# EAGLE schematic ArduinoDevBoardRevA (EAGLE 9.0.1)

## Sheet 1 of 2
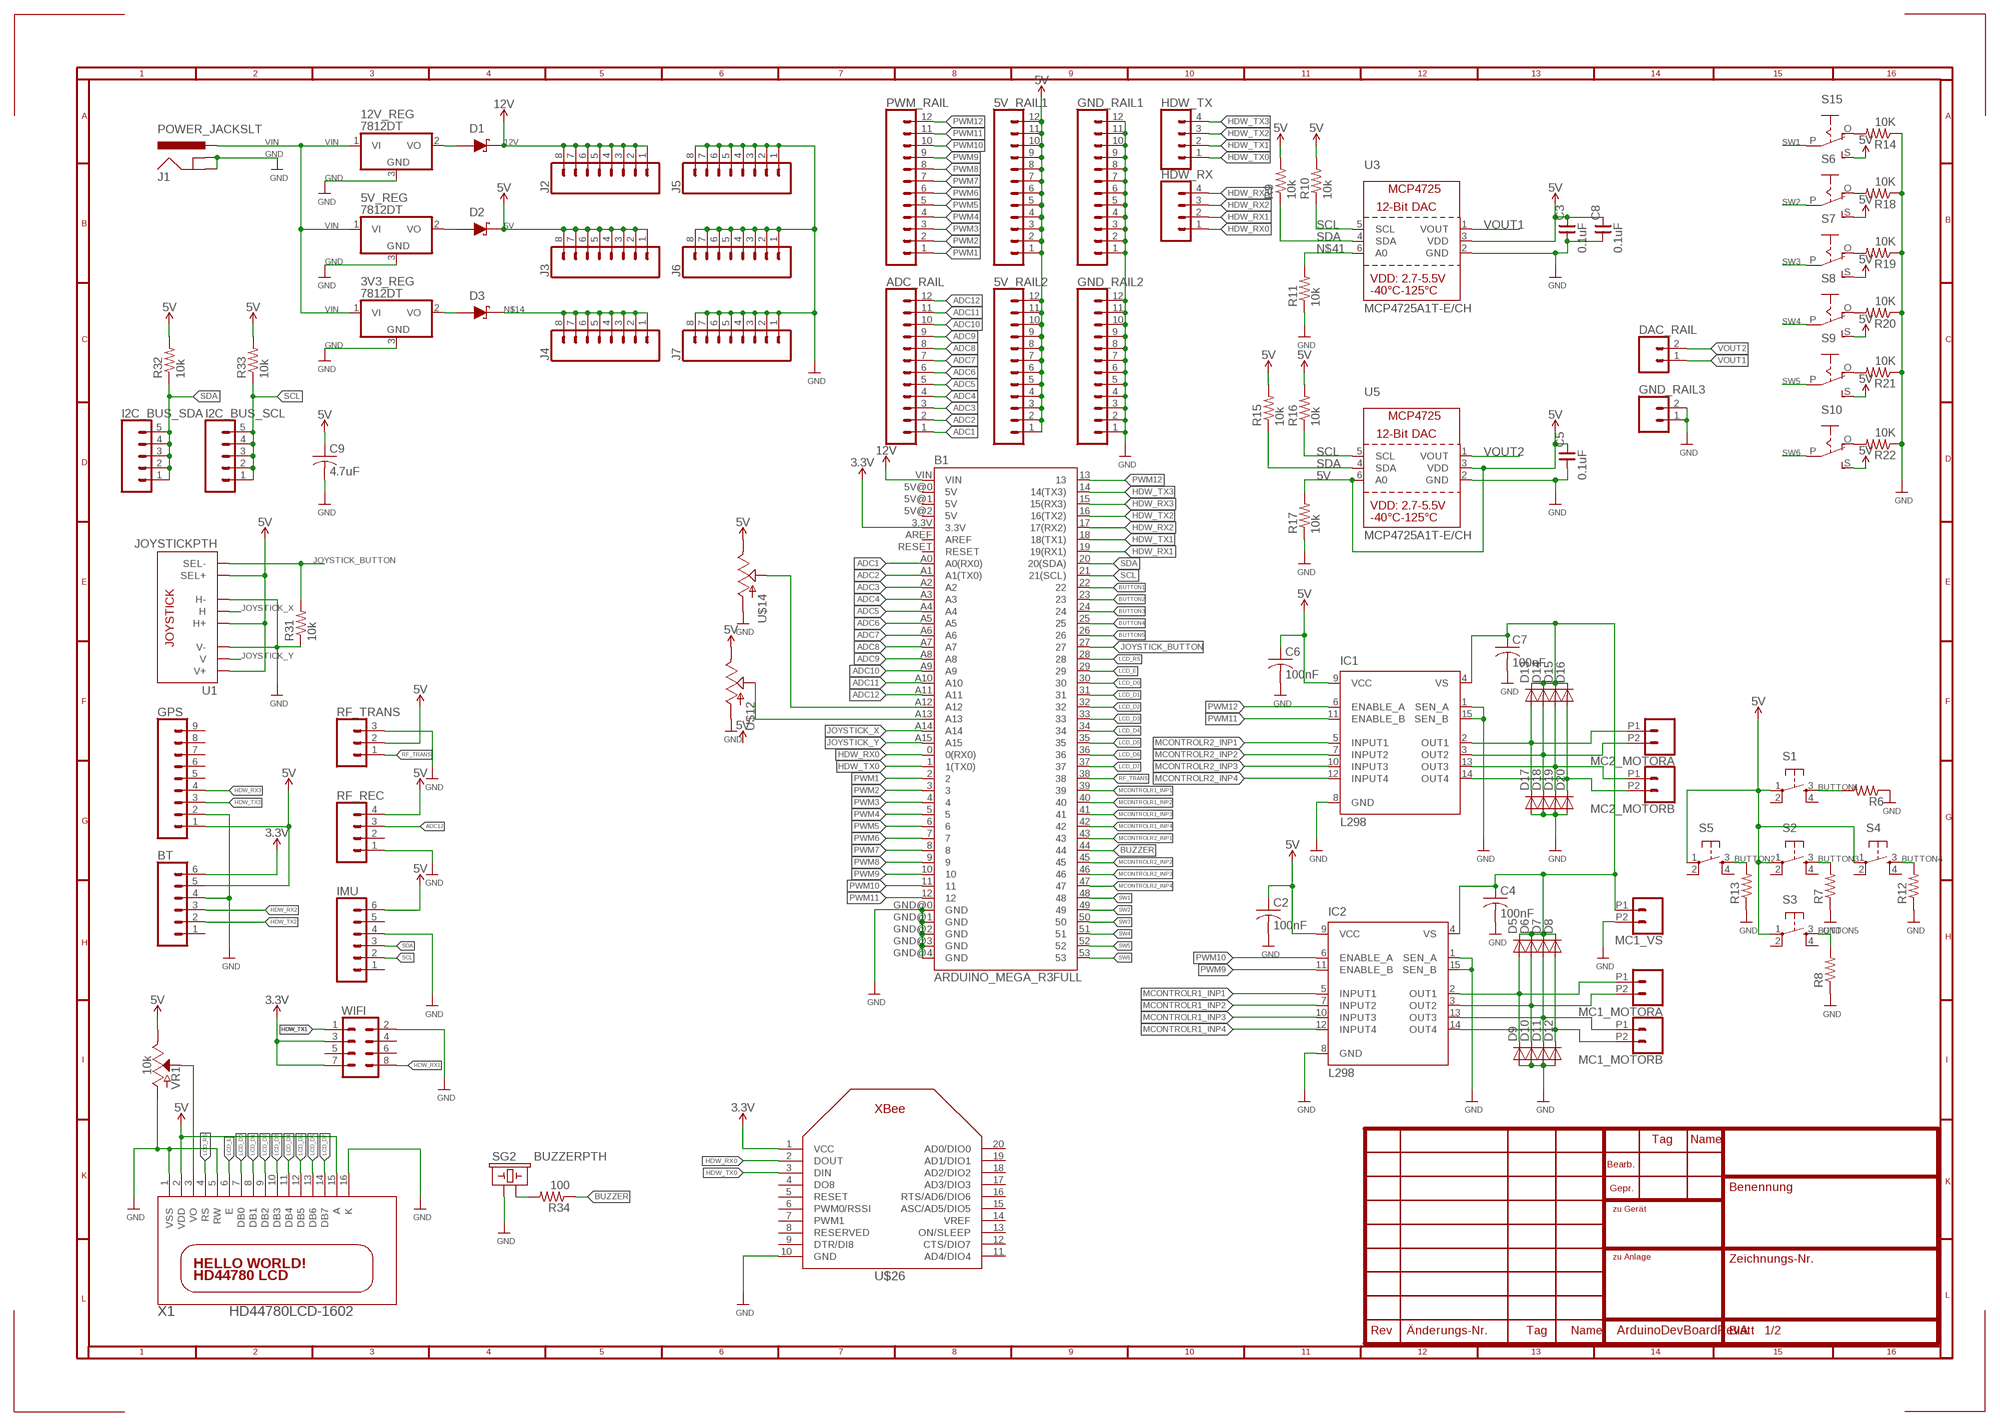
[diagram p0: schematic, sheet 1]

### Parts
3V3_REG  7812DT  [TO252]
5V_RAIL1  CONN_12  [1X12]
5V_RAIL2  CONN_12  [1X12]
5V_REG  7812DT  [TO252]
12V_REG  7812DT  [TO252]
ADC_RAIL  CONN_12  [1X12]
B1  ARDUINO_MEGA_R3FULL  [ARDUINO_MEGA]
BT  CONN_06SILK_FEMALE_PTH  [1X06]
C2  100nF  C-US050-024X044  [C050-024X044]
C3  0.1uF  CNP-0805  [0805]
C4  100nF  C-US050-024X044  [C050-024X044]
C5  0.1uF  CNP-0805  [0805]
C6  100nF  C-US050-024X044  [C050-024X044]
C7  100nF  C-US050-024X044  [C050-024X044]
C8  0.1uF  CNP-0805  [0805]
C9  4.7uF  C-US050-024X044  [C050-024X044]
D1  D_SCHOTTKYK  [SOD-123]
D2  D_SCHOTTKYK  [SOD-123]
D3  D_SCHOTTKYK  [SOD-123]
D5  DIODE-D-5  [D-5]
D6  DIODE-D-5  [D-5]
D7  DIODE-D-5  [D-5]
D8  DIODE-D-5  [D-5]
D9  DIODE-D-5  [D-5]
D10  DIODE-D-5  [D-5]
D11  DIODE-D-5  [D-5]
D12  DIODE-D-5  [D-5]
D13  DIODE-D-5  [D-5]
D14  DIODE-D-5  [D-5]
D15  DIODE-D-5  [D-5]
D16  DIODE-D-5  [D-5]
D17  DIODE-D-5  [D-5]
D18  DIODE-D-5  [D-5]
D19  DIODE-D-5  [D-5]
D20  DIODE-D-5  [D-5]
DAC_RAIL  CONN_02  [1X02]
GND_RAIL1  CONN_12  [1X12]
GND_RAIL2  CONN_12  [1X12]
GND_RAIL3  CONN_02  [1X02]
GPS  CONN_09  [1X09]
HDW_RX  CONN_04  [1X04]
HDW_TX  CONN_04  [1X04]
I2C_BUS_SCL  CONN_05  [1X05]
I2C_BUS_SDA  CONN_05  [1X05]
IC1  L298  [MULTIWATT-15]
IC2  L298  [MULTIWATT-15]
IMU  CONN_06SILK_FEMALE_PTH  [1X06]
J1  POWER_JACKSLT  [POWER_JACK_SLOT]
J2  CONN_08"  [1X08]
J3  CONN_08"  [1X08]
J4  CONN_08"  [1X08]
J5  CONN_08"  [1X08]
J6  CONN_08"  [1X08]
J7  CONN_08"  [1X08]
MC1_MOTORA  CONN_022.54MM_SCREWTERM  [1X02_2.54_SCREWTERM]
MC1_MOTORB  CONN_022.54MM_SCREWTERM  [1X02_2.54_SCREWTERM]
MC1_VS  CONN_022.54MM_SCREWTERM  [1X02_2.54_SCREWTERM]
MC2_MOTORA  CONN_022.54MM_SCREWTERM  [1X02_2.54_SCREWTERM]
MC2_MOTORB  CONN_022.54MM_SCREWTERM  [1X02_2.54_SCREWTERM]
PWM_RAIL  CONN_12  [1X12]
R6  R-US_R0805  [R0805]
R7  R-US_R0805  [R0805]
R8  R-US_R0805  [R0805]
R9  10k  R-US_R0805  [R0805]
R10  10k  R-US_R0805  [R0805]
R11  10k  R-US_R0805  [R0805]
R12  R-US_R0805  [R0805]
R13  R-US_R0805  [R0805]
R14  10K  R-US_R0805  [R0805]
R15  10k  R-US_R0805  [R0805]
R16  10k  R-US_R0805  [R0805]
R17  10k  R-US_R0805  [R0805]
R18  10K  R-US_R0805  [R0805]
R19  10K  R-US_R0805  [R0805]
R20  10K  R-US_R0805  [R0805]
R21  10K  R-US_R0805  [R0805]
R22  10K  R-US_R0805  [R0805]
R31  10k  R-US_R0805  [R0805]
R32  10k  R-US_R0805  [R0805]
R33  10k  R-US_R0805  [R0805]
R34  100  R-US_R0805  [R0805]
RF_REC  CONN_04  [1X04]
RF_TRANS  CONN_03  [1X03]
S1  TAC_SWITCHSMD  [TACTILE_SWITCH_SMD]
S2  TAC_SWITCHSMD  [TACTILE_SWITCH_SMD]
S3  TAC_SWITCHSMD  [TACTILE_SWITCH_SMD]
S4  TAC_SWITCHSMD  [TACTILE_SWITCH_SMD]
S5  TAC_SWITCHSMD  [TACTILE_SWITCH_SMD]
S6  EG1218S  [EG1218]
S7  EG1218S  [EG1218]
S8  EG1218S  [EG1218]
S9  EG1218S  [EG1218]
S10  EG1218S  [EG1218]
S15  EG1218S  [EG1218]
SG2  BUZZERPTH  [BUZZER-12MM]
U1  JOYSTICKPTH  [JOYSTICK]
U3  MCP4725A1T-E/CH  DAC_MCP4725  [SOT23-6]
U5  MCP4725A1T-E/CH  DAC_MCP4725  [SOT23-6]
U$12  POT  [ALPS_POT]
U$14  POT  [ALPS_POT]
U$26  XBEE  [XBEE]
VR1  10k  POTENTIOMETER-PTH-9MM-1/20W-20%-KIT  [POT-PTH-ALPS-KIT]
WIFI  CONN_04X2  [2X4]
X1  HD44780LCD-1602  [LCD1602]

### Nets
3.3V: B1.3.3V BT.6 U$26.1(VCC) WIFI.3 WIFI.7
5V: 5V_RAIL1.1 5V_RAIL1.2 5V_RAIL1.3 5V_RAIL1.4 5V_RAIL1.5 5V_RAIL1.6 5V_RAIL1.7 5V_RAIL1.8 5V_RAIL1.9 5V_RAIL1.10 5V_RAIL1.11 5V_RAIL1.12 5V_RAIL2.1 5V_RAIL2.2 5V_RAIL2.3 5V_RAIL2.4 5V_RAIL2.5 5V_RAIL2.6 5V_RAIL2.7 5V_RAIL2.8 5V_RAIL2.9 5V_RAIL2.10 5V_RAIL2.11 5V_RAIL2.12 BT.5 C2.1 C3.2 C5.2 C6.1 C8.2 C9.1 D2.2(C) GPS.1 IC1.9(VCC) IC2.9(VCC) IMU.6 J3.1 J3.2 J3.3 J3.4 J3.5 J3.6 J3.7 J3.8 R9.2 R10.2 R15.2 R16.2 R17.2 R32.2 R33.2 RF_REC.4 RF_TRANS.2 S1.1 S2.1 S3.1 S4.1 S5.1 S6.S S7.S S8.S S9.S S10.S S15.S U1.B1A(SEL+) U1.H1(H+) U1.V1(V+) U3.3(VDD) U5.3(VDD) U5.6(A0) U$12.P$1(E) U$14.P$1(E) VR1.P$1(E) X1.2(VDD) X1.15(A) ; also sheet 2
12V: B1.VIN D1.2(C) J2.1 J2.2 J2.3 J2.4 J2.5 J2.6 J2.7 J2.8
ADC1: ADC_RAIL.1 B1.A0(A0(RX0)) ; also sheet 2
ADC2: ADC_RAIL.2 B1.A1(A1(TX0)) ; also sheet 2
ADC3: ADC_RAIL.3 B1.A2 ; also sheet 2
ADC4: ADC_RAIL.4 B1.A3
ADC5: ADC_RAIL.5 B1.A4
ADC6: ADC_RAIL.6 B1.A5
ADC7: ADC_RAIL.7 B1.A6
ADC8: ADC_RAIL.8 B1.A7
ADC9: ADC_RAIL.9 B1.A8
ADC10: ADC_RAIL.10 B1.A9
ADC11: ADC_RAIL.11 B1.A10
ADC12: ADC_RAIL.12 B1.A11 RF_REC.3
BUTTON1: B1.22 R6.2 S1.3
BUTTON2: B1.23 R13.2 S5.3
BUTTON3: B1.24 R7.2 S2.3
BUTTON4: B1.25 R12.2 S4.3
BUTTON5: B1.26 R8.2 S3.3
BUZZER: B1.44 R34.1
GND: 3V3_REG.3(GND) 5V_REG.3(GND) 12V_REG.3(GND) B1.GND@0(GND) B1.GND@1(GND) B1.GND@2(GND) B1.GND@3(GND) B1.GND@4(GND) BT.4 C2.2 C3.1 C4.2 C5.1 C6.2 C7.2 C8.1 C9.2 D9.A D10.A D11.A D12.A D17.A D18.A D19.A D20.A GND_RAIL1.1 GND_RAIL1.2 GND_RAIL1.3 GND_RAIL1.4 GND_RAIL1.5 GND_RAIL1.6 GND_RAIL1.7 GND_RAIL1.8 GND_RAIL1.9 GND_RAIL1.10 GND_RAIL1.11 GND_RAIL1.12 GND_RAIL2.1 GND_RAIL2.2 GND_RAIL2.3 GND_RAIL2.4 GND_RAIL2.5 GND_RAIL2.6 GND_RAIL2.7 GND_RAIL2.8 GND_RAIL2.9 GND_RAIL2.10 GND_RAIL2.11 GND_RAIL2.12 GND_RAIL3.1 GND_RAIL3.2 GPS.2 IC1.1(SEN_A) IC1.8(GND) IC1.15(SEN_B) IC2.1(SEN_A) IC2.8(GND) IC2.15(SEN_B) IMU.4 J1.GND@1(GNDBREAK) J1.GND@2(GND) J5.1 J5.2 J5.3 J5.4 J5.5 J5.6 J5.7 J5.8 J6.1 J6.2 J6.3 J6.4 J6.5 J6.6 J6.7 J6.8 J7.1 J7.2 J7.3 J7.4 J7.5 J7.6 J7.7 J7.8 MC1_VS.P2 R6.1 R7.1 R8.1 R11.1 R12.1 R13.1 R14.1 R17.1 R18.1 R19.1 R20.1 R21.1 R22.1 R31.1 RF_REC.1 RF_TRANS.3 SG2.+ U1.H3(H-) U1.V3(V-) U3.2(GND) U5.2(GND) U$12.P$3(A) U$14.P$3(A) U$26.10(GND) VR1.P$3(A) WIFI.2 X1.1(VSS) X1.5(RW) X1.16(K) ; also sheet 2
HDW_RX0: B1.0(0(RX0)) HDW_RX.1 U$26.2(DOUT)
HDW_RX1: B1.19(19(RX1)) HDW_RX.2 WIFI.8
HDW_RX2: B1.17(17(RX2)) BT.3 HDW_RX.3
HDW_RX3: B1.15(15(RX3)) GPS.4 HDW_RX.4
HDW_TX0: B1.1(1(TX0)) HDW_TX.1 U$26.3(DIN)
HDW_TX1: B1.18(18(TX1)) HDW_TX.2 WIFI.1
HDW_TX2: B1.16(16(TX2)) BT.2 HDW_TX.3
HDW_TX3: B1.14(14(TX3)) GPS.3 HDW_TX.4
JOYSTICK_BUTTON: B1.27 R31.2 U1.B2A(SEL-)
JOYSTICK_X: B1.A14 U1.H2(H)
JOYSTICK_Y: B1.A15 U1.V2(V)
LCD_D0: B1.30 X1.7(DB0)
LCD_D1: B1.31 X1.8(DB1)
LCD_D2: B1.32 X1.9(DB2)
LCD_D3: B1.33 X1.10(DB3)
LCD_D4: B1.34 X1.11(DB4)
LCD_D5: B1.35 X1.12(DB5)
LCD_D6: B1.36 X1.13(DB6)
LCD_D7: B1.37 X1.14(DB7)
LCD_E: B1.29 X1.6(E)
LCD_RS: B1.28 X1.4(RS)
MCONTROLR1_INP1: B1.39 IC2.5(INPUT1)
MCONTROLR1_INP2: B1.40 IC2.7(INPUT2)
MCONTROLR1_INP3: B1.41 IC2.10(INPUT3)
MCONTROLR1_INP4: B1.42 IC2.12(INPUT4)
MCONTROLR2_INP1: B1.43 IC1.5(INPUT1)
MCONTROLR2_INP2: B1.45 IC1.7(INPUT2)
MCONTROLR2_INP3: B1.46 IC1.10(INPUT3)
MCONTROLR2_INP4: B1.47 IC1.12(INPUT4)
N$5: 12V_REG.2(VO) D1.1(A)
N$10: 5V_REG.2(VO) D2.1(A)
N$11: 3V3_REG.2(VO) D3.1(A)
N$12: C4.1 C7.1 D5.C D6.C D7.C D8.C D13.C D14.C D15.C D16.C IC1.4(VS) IC2.4(VS) MC1_VS.P1
N$14: D3.2(C) J4.1 J4.2 J4.3 J4.4 J4.5 J4.6 J4.7 J4.8
N$33: D13.A D17.C IC1.2(OUT1) MC2_MOTORA.P1
N$34: D14.A D18.C IC1.3(OUT2) MC2_MOTORA.P2
N$35: D15.A D19.C IC1.13(OUT3) MC2_MOTORB.P1
N$36: D16.A D20.C IC1.14(OUT4) MC2_MOTORB.P2
N$37: B1.A12 U$14.P$2(S)
N$38: B1.A13 U$12.P$2(S)
N$39: VR1.P$2(S) X1.3(VO)
N$40: R34.2 SG2.-
N$41: R11.2 U3.6(A0)
N$46: D5.A D9.C IC2.2(OUT1) MC1_MOTORA.P1
N$47: D6.A D10.C IC2.3(OUT2) MC1_MOTORA.P2
N$48: D7.A D11.C IC2.13(OUT3) MC1_MOTORB.P1
N$49: D8.A D12.C IC2.14(OUT4) MC1_MOTORB.P2
N$50: R14.2 S15.O
N$52: R18.2 S6.O
N$53: R19.2 S7.O
N$54: R20.2 S8.O
N$55: R21.2 S9.O
N$56: R22.2 S10.O
PWM1: B1.2 PWM_RAIL.1
PWM2: B1.3 PWM_RAIL.2
PWM3: B1.4 PWM_RAIL.3
PWM4: B1.5 PWM_RAIL.4
PWM5: B1.6 PWM_RAIL.5
PWM6: B1.7 PWM_RAIL.6
PWM7: B1.8 PWM_RAIL.7
PWM8: B1.9 PWM_RAIL.8
PWM9: B1.10 IC2.11(ENABLE_B) PWM_RAIL.9
PWM10: B1.11 IC2.6(ENABLE_A) PWM_RAIL.10
PWM11: B1.12 IC1.11(ENABLE_B) PWM_RAIL.11
PWM12: B1.13 IC1.6(ENABLE_A) PWM_RAIL.12
RF_TRANS: B1.38 RF_TRANS.1
SCL: B1.21(21(SCL)) I2C_BUS_SCL.1 I2C_BUS_SCL.2 I2C_BUS_SCL.3 I2C_BUS_SCL.4 I2C_BUS_SCL.5 IMU.2 R10.1 R16.1 R33.1 U3.5(SCL) U5.5(SCL) ; also sheet 2
SDA: B1.20(20(SDA)) I2C_BUS_SDA.1 I2C_BUS_SDA.2 I2C_BUS_SDA.3 I2C_BUS_SDA.4 I2C_BUS_SDA.5 IMU.3 R9.1 R15.1 R32.1 U3.4(SDA) U5.4(SDA) ; also sheet 2
SW1: B1.48 S15.P
SW2: B1.49 S6.P
SW3: B1.50 S7.P
SW4: B1.51 S8.P
SW5: B1.52 S9.P
SW6: B1.53 S10.P
VIN: 3V3_REG.1(VI) 5V_REG.1(VI) 12V_REG.1(VI) J1.PWR
VOUT1: DAC_RAIL.1 U3.1(VOUT)
VOUT2: DAC_RAIL.2 U5.1(VOUT)
Unconnected: B1.5V@0(5V) B1.5V@1(5V) B1.5V@2(5V) B1.AREF B1.RESET BT.1 GPS.5 GPS.6 GPS.7 GPS.8 GPS.9 IMU.1 IMU.5 RF_REC.2 S1.2 S1.4 S2.2 S2.4 S3.2 S3.4 S4.2 S4.4 S5.2 S5.4 U$26.4(DO8) U$26.5(RESET) U$26.6(PWM0/RSSI) U$26.7(PWM1) U$26.8(RESERVED) U$26.9(DTR/DI8) U$26.11(AD4/DIO4) U$26.12(CTS/DIO7) U$26.13(ON/SLEEP) U$26.14(VREF) U$26.15(ASC/AD5/DIO5) U$26.16(RTS/AD6/DIO6) U$26.17(AD3/DIO3) U$26.18(AD2/DIO2) U$26.19(AD1/DIO1) U$26.20(AD0/DIO0) WIFI.4 WIFI.5 WIFI.6

## Sheet 2 of 2
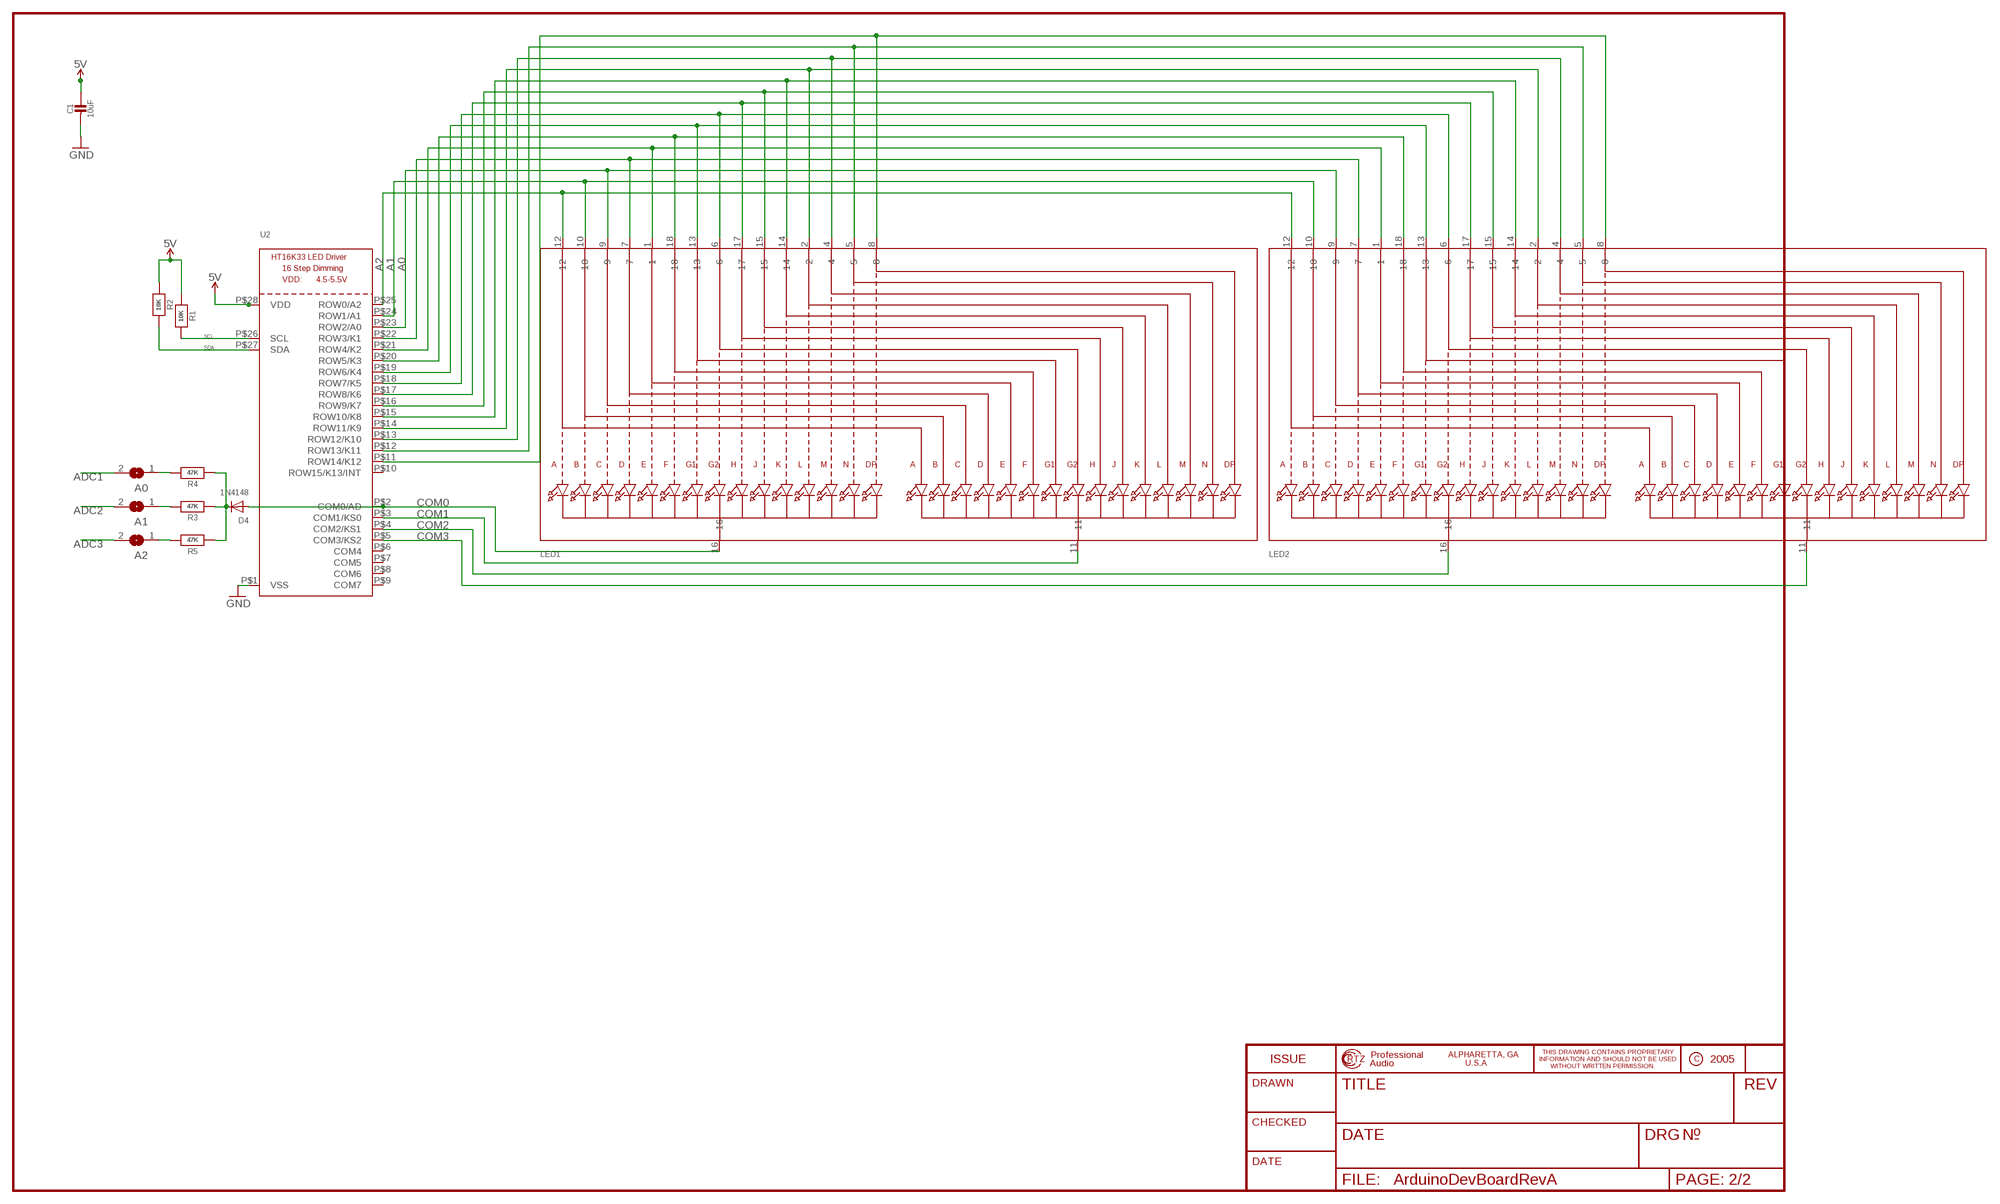
[diagram p1: schematic, sheet 2]

### Parts
A0  SOLDERJUMPERREFLOW_NOPASTE  [SOLDERJUMPER_REFLOW_NOPASTE]
A1  SOLDERJUMPERREFLOW_NOPASTE  [SOLDERJUMPER_REFLOW_NOPASTE]
A2  SOLDERJUMPERREFLOW_NOPASTE  [SOLDERJUMPER_REFLOW_NOPASTE]
C1  10uF  CAP_CERAMIC0805-NOOUTLINE  [0805-NO]
D4  1N4148  DIODESOD-323F  [SOD-323F]
LED1  DISP_SEGMENT_STARBURST_DUAL_COMMONCATHODE  [SEGMENT_STARTBUST_DUAL_KWA-541CBB]
LED2  DISP_SEGMENT_STARBURST_DUAL_COMMONCATHODE  [SEGMENT_STARTBUST_DUAL_KWA-541CBB]
R1  10K  RESISTOR0805_NOOUTLINE  [0805-NO]
R2  10K  RESISTOR0805_NOOUTLINE  [0805-NO]
R3  47K  RESISTOR0805_NOOUTLINE  [0805-NO]
R4  47K  RESISTOR0805_NOOUTLINE  [0805-NO]
R5  47K  RESISTOR0805_NOOUTLINE  [0805-NO]
U2  HT16K33_SOP28  [SOP28_300MIL]

### Nets
5V: R1.1 R2.1 U2.P$28(VDD) ; also sheet 1
A0: LED1.9 LED2.9 U2.P$23(ROW2/A0)
A1: LED1.10 LED2.10 U2.P$24(ROW1/A1)
A2: LED1.12 LED2.12 U2.P$25(ROW0/A2)
ADC1: A0.2 ; also sheet 1
ADC2: A1.2 ; also sheet 1
ADC3: A2.2 ; also sheet 1
COM0: D4.A LED1.16 U2.P$2(COM0/AD)
COM1: LED1.11 U2.P$3(COM1/KS0)
COM2: LED2.16 U2.P$4(COM2/KS1)
COM3: LED2.11 U2.P$5(COM3/KS2)
GND: C1.2 U2.P$1(VSS) ; also sheet 1
N$1: C1.1
N$16: LED1.7 LED2.7 U2.P$22(ROW3/K1)
N$17: LED1.1 LED2.1 U2.P$21(ROW4/K2)
N$18: LED1.18 LED2.18 U2.P$20(ROW5/K3)
N$19: A1.1 R3.2
N$20: A0.1 R4.2
N$21: LED1.13 LED2.13 U2.P$19(ROW6/K4)
N$22: LED1.6 LED2.6 U2.P$18(ROW7/K5)
N$23: D4.C R3.1 R4.1 R5.1
N$24: A2.1 R5.2
N$25: LED1.17 LED2.17 U2.P$17(ROW8/K6)
N$26: LED1.15 LED2.15 U2.P$16(ROW9/K7)
N$27: LED1.14 LED2.14 U2.P$15(ROW10/K8)
N$28: LED1.2 LED2.2 U2.P$14(ROW11/K9)
N$29: LED1.4 LED2.4 U2.P$13(ROW12/K10)
N$30: LED1.5 LED2.5 U2.P$12(ROW13/K11)
N$31: LED1.8 LED2.8 U2.P$11(ROW14/K12)
SCL: R1.2 U2.P$26(SCL) ; also sheet 1
SDA: R2.2 U2.P$27(SDA) ; also sheet 1
Unconnected: U2.P$6(COM4) U2.P$7(COM5) U2.P$8(COM6) U2.P$9(COM7) U2.P$10(ROW15/K13/INT)

## Library data of the parts
3V3_REG 5V_REG 12V_REG = adafruit:78*: Positive VOLTAGE REGULATOR Added bigger pads to the TO-92 package
5V_RAIL1 5V_RAIL2 ADC_RAIL GND_RAIL1 GND_RAIL2 PWM_RAIL = SparkFun-Connectors:CONN_12: Multi connection point. Often used as Generic Header-pin footprint for 0.1 inch spaced/style header connections On any of the 0.1 inch spaced packages, you can populate with these: Break Away Headers - Straight <https://www.sparkfun.com/products/116> (PRT-00116) Break Away Male Headers - Right Angle <https://www.sparkfun.com/products/553> (PRT-00553) Female Headers <https://www.sparkfun.com/products/115> (PRT-00115) Break Away Headers - Machine Pin <https://www.sparkfun.com/products/117> (PRT-00117) Break Away Female Headers - Swiss Machine Pin <https://www.sparkfun.com/products/743> (PRT-00743) For SCREWTERMINALS and SPRING TERMINALS visit here: Screw Terimnals on SparkFun.com <https://www.sparkfun.com/search/results?term=Screw+Terminals> (5mm/3.5mm/2.54mm spacing) This device is also useful as a general connection point to wire up your design to another part of your project. Our various solder wires solder well into these plated through hole pads. Hook-Up Wire - Assortment (Stranded, 22 AWG) <https://www.sparkfun.com/products/11375> (PRT-11375) Hook-Up Wire - Assortment (Solid Core, 22 AWG) <https://www.sparkfun.com/products/11367> (PRT-11367) View the entire wire category on our website here <https://www.sparkfun.com/categories/141> Special notes: Molex polarized connector foot print use with SKU : PRT-08231 with associated crimp pins and housings. 1MM SMD Version SKU: PRT-10208 NOTES ON THE VARIANTS LOCK and LOCK_LONGPADS... This footprint was designed to help hold the alignment of a through-hole component (i.e. 6-pin header) while soldering it into place. You may notice that each hole has been shifted either up or down by 0.005 of an inch from it's more standard position (which is a perfectly straight line). This slight alteration caused the pins (the squares in the middle) to touch the edges of the holes. Because they are alternating, it causes a "brace" to hold the component in place. 0.005 has proven to be the perfect amount of "off-center" position when using our standard breakaway headers. Although looks a little odd when you look at the bare footprint, once you have a header in there, the alteration is very hard to notice. Also,if you push a header all the way into place, it is covered up entirely on the bottom side.
A0 A1 A2 = microbuilder:SOLDERJUMPER: SMD Solder JUMPER Solder the two pads together to create a connection, or remove the solder to break it. REFLOW - Use this footprint for solder paste and reflow ovens. WAVE - Use this footprint for hand-soldering (larger pads). CLOSED - Has a trace between the two pads to ensure it is closed by default. The trace needs to be cut to disable the jumper, and can be closed again by creating a solder bridge between the two pads.
B1 = SparkFun-Boards:ARDUINO_MEGA_R3: Arduino Mega R3 ATmega2560 R3 compatible footprint. SparkFun Products: Arduino Mega 2560 R3 <https://www.sparkfun.com/products/11061>
BT IMU = SparkFun-Connectors:CONN_06: Multi connection point. Often used as Generic Header-pin footprint for 0.1 inch spaced/style header connections On any of the 0.1 inch spaced packages, you can populate with these: Break Away Headers - Straight <https://www.sparkfun.com/products/116> (PRT-00116) Break Away Male Headers - Right Angle <https://www.sparkfun.com/products/553> (PRT-00553) Female Headers <https://www.sparkfun.com/products/115> (PRT-00115) Break Away Headers - Machine Pin <https://www.sparkfun.com/products/117> (PRT-00117) Break Away Female Headers - Swiss Machine Pin <https://www.sparkfun.com/products/743> (PRT-00743) Arduino Stackable Header - 6 Pin <https://www.sparkfun.com/products/9280> (PRT-09280) For SCREWTERMINALS and SPRING TERMINALS visit here: Screw Terimnals on SparkFun.com <https://www.sparkfun.com/search/results?term=Screw+Terminals> (5mm/3.5mm/2.54mm spacing) This device is also useful as a general connection point to wire up your design to another part of your project. Our various solder wires solder well into these plated through hole pads. Hook-Up Wire - Assortment (Stranded, 22 AWG) <https://www.sparkfun.com/products/11375> (PRT-11375) Hook-Up Wire - Assortment (Solid Core, 22 AWG) <https://www.sparkfun.com/products/11367> (PRT-11367) View the entire wire category on our website here <https://www.sparkfun.com/categories/141>; PROD_ID: CONN-08437
C1 = microbuilder:CAP_CERAMIC: Ceramic Capacitors For new designs, use the packages preceded by an '_' character since they are more reliable: The following footprints should be used on most boards: _0402 - Standard footprint for regular board layouts _0603 - Standard footprint for regular board layouts _0805 - Standard footprint for regular board layouts _1206 - Standard footprint for regular board layouts For extremely tight-pitch boards where space is at a premium, the following 'micro-pitch' footprints can be used (smaller pads, no silkscreen outline, etc.): _0402MP - Micro-pitch footprint for very dense/compact boards _0603MP - Micro-pitch footprint for very dense/compact boards _0805MP - Micro-pitch footprint for very dense/compact boards _1206MP - Micro-pitch footprint for very dense/compact boards
C2 C4 C6 C7 C9 = rcl:C-US: CAPACITOR, American symbol; SPICEPREFIX: C
C3 C5 C8 = cap-master:CNP-: NON-POLARIZED CAP
D1-D3 = MAX9812:D_SCHOTTKY: Schottky diodes in various packages
D4 = adafruit:DIODE: Diode SMADIODE - SMA Surface Mount Package 20V 1A Schottky Diode Digikey: 641-1014-6-ND DO-1N4148 - Through Hole Small Current Diode SOD-123 20V 1 A (.5mV Vf) Schottky Diode - Digikey: MBRX120TPMSCT-ND SOD-323 10V 570mA (.38mV Vf, 3ns) Schottky Diode - Digikey: ZLLS410CT-ND SOD-523 30V 30mA Schottky Diode (RB751S-40TE61) - Digikey: RB751S-40TE61CT-ND SOT23-R/W - SOT23 Package (R = Solder Paste/Reflow Ovens, W = Hand-Soldering) BAT54Film 40V 300mA - Digikey: 497-7162-1-ND
D5-D20 = diode:DIODE-: DIODE
DAC_RAIL GND_RAIL3 MC1_MOTORA MC1_MOTORB MC1_VS MC2_MOTORA MC2_MOTORB = SparkFun-Connectors:CONN_02: Multi connection point. Often used as Generic Header-pin footprint for 0.1 inch spaced/style header connections On any of the 0.1 inch spaced packages, you can populate with these: Break Away Headers - Straight <https://www.sparkfun.com/products/116> (PRT-00116) Break Away Male Headers - Right Angle <https://www.sparkfun.com/products/553> (PRT-00553) Female Headers <https://www.sparkfun.com/products/115> (PRT-00115) Break Away Headers - Machine Pin <https://www.sparkfun.com/products/117> (PRT-00117) Break Away Female Headers - Swiss Machine Pin <https://www.sparkfun.com/products/743> (PRT-00743) For SCREWTERMINALS and SPRING TERMINALS visit here: Screw Terimnals on SparkFun.com <https://www.sparkfun.com/search/results?term=Screw+Terminals> (5mm/3.5mm/2.54mm spacing) This device is also useful as a general connection point to wire up your design to another part of your project. Our various solder wires solder well into these plated through hole pads. Hook-Up Wire - Assortment (Stranded, 22 AWG) <https://www.sparkfun.com/products/11375> (PRT-11375) Hook-Up Wire - Assortment (Solid Core, 22 AWG) <https://www.sparkfun.com/products/11367> (PRT-11367) View the entire wire category on our website here <https://www.sparkfun.com/categories/141> Special notes: Molex polarized connector foot print use with: PRT-08233 with associated crimp pins and housings. 2.54_SCREWTERM for use with PRT-10571. 3.5mm Screw Terminal footprints for PRT-08084 5mm Screw Terminal footprints for use with PRT-08432
GPS = SparkFun-Connectors:CONN_09: Multi connection point. Often used as Generic Header-pin footprint for 0.1 inch spaced/style header connections On any of the 0.1 inch spaced packages, you can populate with these: Break Away Headers - Straight <https://www.sparkfun.com/products/116> (PRT-00116) Break Away Male Headers - Right Angle <https://www.sparkfun.com/products/553> (PRT-00553) Female Headers <https://www.sparkfun.com/products/115> (PRT-00115) Break Away Headers - Machine Pin <https://www.sparkfun.com/products/117> (PRT-00117) Break Away Female Headers - Swiss Machine Pin <https://www.sparkfun.com/products/743> (PRT-00743) For SCREWTERMINALS and SPRING TERMINALS visit here: Screw Terimnals on SparkFun.com <https://www.sparkfun.com/search/results?term=Screw+Terminals> (5mm/3.5mm/2.54mm spacing) This device is also useful as a general connection point to wire up your design to another part of your project. Our various solder wires solder well into these plated through hole pads. Hook-Up Wire - Assortment (Stranded, 22 AWG) <https://www.sparkfun.com/products/11375> (PRT-11375) Hook-Up Wire - Assortment (Solid Core, 22 AWG) <https://www.sparkfun.com/products/11367> (PRT-11367) View the entire wire category on our website here <https://www.sparkfun.com/categories/141> Special notes: Molex polarized connector foot print use with SKU : PRT-08231 with associated crimp pins and housings. 1MM SMD Version SKU: PRT-10208 NOTES ON THE VARIANTS LOCK and LOCK_LONGPADS... This footprint was designed to help hold the alignment of a through-hole component (i.e. 6-pin header) while soldering it into place. You may notice that each hole has been shifted either up or down by 0.005 of an inch from it's more standard position (which is a perfectly straight line). This slight alteration caused the pins (the squares in the middle) to touch the edges of the holes. Because they are alternating, it causes a "brace" to hold the component in place. 0.005 has proven to be the perfect amount of "off-center" position when using our standard breakaway headers. Although looks a little odd when you look at the bare footprint, once you have a header in there, the alteration is very hard to notice. Also,if you push a header all the way into place, it is covered up entirely on the bottom side.
HDW_RX HDW_TX RF_REC = SparkFun-Connectors:CONN_04: Multi connection point. Often used as Generic Header-pin footprint for 0.1 inch spaced/style header connections On any of the 0.1 inch spaced packages, you can populate with these: Break Away Headers - Straight <https://www.sparkfun.com/products/116> (PRT-00116) Break Away Male Headers - Right Angle <https://www.sparkfun.com/products/553> (PRT-00553) Female Headers <https://www.sparkfun.com/products/115> (PRT-00115) Break Away Headers - Machine Pin <https://www.sparkfun.com/products/117> (PRT-00117) Break Away Female Headers - Swiss Machine Pin <https://www.sparkfun.com/products/743> (PRT-00743) For SCREWTERMINALS and SPRING TERMINALS visit here: Screw Terimnals on SparkFun.com <https://www.sparkfun.com/search/results?term=Screw+Terminals> (5mm/3.5mm/2.54mm spacing) This device is also useful as a general connection point to wire up your design to another part of your project. Our various solder wires solder well into these plated through hole pads. Hook-Up Wire - Assortment (Stranded, 22 AWG) <https://www.sparkfun.com/products/11375> (PRT-11375) Hook-Up Wire - Assortment (Solid Core, 22 AWG) <https://www.sparkfun.com/products/11367> (PRT-11367) View the entire wire category on our website here <https://www.sparkfun.com/categories/141> Special notes: Molex polarized connector foot print use with SKU : PRT-08231 with associated crimp pins and housings. 1MM SMD Version SKU: PRT-10208; PROD_ID: CONN-09696
I2C_BUS_SCL I2C_BUS_SDA = SparkFun-Connectors:CONN_05: Multi connection point. Often used as Generic Header-pin footprint for 0.1 inch spaced/style header connections On any of the 0.1 inch spaced packages, you can populate with these: Break Away Headers - Straight <https://www.sparkfun.com/products/116> (PRT-00116) Break Away Male Headers - Right Angle <https://www.sparkfun.com/products/553> (PRT-00553) Female Headers <https://www.sparkfun.com/products/115> (PRT-00115) Break Away Headers - Machine Pin <https://www.sparkfun.com/products/117> (PRT-00117) Break Away Female Headers - Swiss Machine Pin <https://www.sparkfun.com/products/743> (PRT-00743) For SCREWTERMINALS and SPRING TERMINALS visit here: Screw Terimnals on SparkFun.com <https://www.sparkfun.com/search/results?term=Screw+Terminals> (5mm/3.5mm/2.54mm spacing) This device is also useful as a general connection point to wire up your design to another part of your project. Our various solder wires solder well into these plated through hole pads. Hook-Up Wire - Assortment (Stranded, 22 AWG) <https://www.sparkfun.com/products/11375> (PRT-11375) Hook-Up Wire - Assortment (Solid Core, 22 AWG) <https://www.sparkfun.com/products/11367> (PRT-11367) View the entire wire category on our website here <https://www.sparkfun.com/categories/141> Special notes: Molex polarized connector foot print use with SKU : PRT-08231 with associated crimp pins and housings. 1MM SMD Version SKU: PRT-10208
IC1 IC2 = st-microelectronics:L298: DUAL FULL-BRIDGE DRIVER; MPN: L298N; OC_FARNELL: 1589425; OC_NEWARK: 32M1527
J1 = SparkFun:POWER_JACK: Power Jack This is the standard 5.5mm barrel jack for power. The PTH is the most common, proven, reliable, footprint. All others are experimental. The Slot footprint only works if the mill layer is transmitted to the PCB fab house so be warned. Spark Fun Electronics SKU : PRT-00119. Mating wall wart : TOL-00298 (and others)
J2-J7 = SparkFun-Connectors:CONN_08: Multi connection point. Often used as Generic Header-pin footprint for 0.1 inch spaced/style header connections On any of the 0.1 inch spaced packages, you can populate with these: Break Away Headers - Straight <https://www.sparkfun.com/products/116> (PRT-00116) Break Away Male Headers - Right Angle <https://www.sparkfun.com/products/553> (PRT-00553) Female Headers <https://www.sparkfun.com/products/115> (PRT-00115) Break Away Headers - Machine Pin <https://www.sparkfun.com/products/117> (PRT-00117) Break Away Female Headers - Swiss Machine Pin <https://www.sparkfun.com/products/743> (PRT-00743) Arduino Stackable Header - 8 Pin <https://www.sparkfun.com/products/9279> (PRT-09279) For SCREWTERMINALS and SPRING TERMINALS visit here: Screw Terimnals on SparkFun.com <https://www.sparkfun.com/search/results?term=Screw+Terminals> (5mm/3.5mm/2.54mm spacing) This device is also useful as a general connection point to wire up your design to another part of your project. Our various solder wires solder well into these plated through hole pads. Hook-Up Wire - Assortment (Stranded, 22 AWG) <https://www.sparkfun.com/products/11375> (PRT-11375) Hook-Up Wire - Assortment (Solid Core, 22 AWG) <https://www.sparkfun.com/products/11367> (PRT-11367) View the entire wire category on our website here <https://www.sparkfun.com/categories/141> Special notes: Molex polarized connector foot print use with SKU : PRT-08231 with associated crimp pins and housings. 1MM SMD Version SKU: PRT-10208 NOTES ON THE VARIANTS LOCK and LOCK_LONGPADS... This footprint was designed to help hold the alignment of a through-hole component (i.e. 6-pin header) while soldering it into place. You may notice that each hole has been shifted either up or down by 0.005 of an inch from it's more standard position (which is a perfectly straight line). This slight alteration caused the pins (the squares in the middle) to touch the edges of the holes. Because they are alternating, it causes a "brace" to hold the component in place. 0.005 has proven to be the perfect amount of "off-center" position when using our standard breakaway headers. Although looks a little odd when you look at the bare footprint, once you have a header in there, the alteration is very hard to notice. Also,if you push a header all the way into place, it is covered up entirely on the bottom side.; PROD_ID: CONN-08438
LED1 LED2 = microbuilder:DISP_SEGMENT_STARBURST_DUAL_COMMONCATHODE: 2 x Starburst Segment Displays - Common Cathode Luckylight KWA-541CBB
R1-R5 = microbuilder:RESISTOR: Resistors For new designs, use the packages preceded by an '_' character since they are more reliable: The following footprints should be used on most boards: _0402 - Standard footprint for regular board layouts _0603 - Standard footprint for regular board layouts _0805 - Standard footprint for regular board layouts _1206 - Standard footprint for regular board layouts For extremely tight-pitch boards where space is at a premium, the following 'micro-pitch' footprints can be used (smaller pads, no silkscreen outline, etc.): _0402MP - Micro-pitch footprint for very dense/compact boards _0603MP - Micro-pitch footprint for very dense/compact boards _0805MP - Micro-pitch footprint for very dense/compact boards _1206MP - Micro-pitch footprint for very dense/compact boards
R6-R22 R31-R34 = adafruit:R-US_: RESISTOR, American symbol
RF_TRANS = SparkFun-Connectors:CONN_03: Multi connection point. Often used as Generic Header-pin footprint for 0.1 inch spaced/style header connections On any of the 0.1 inch spaced packages, you can populate with these: Break Away Headers - Straight <https://www.sparkfun.com/products/116> (PRT-00116) Break Away Male Headers - Right Angle <https://www.sparkfun.com/products/553> (PRT-00553) Female Headers <https://www.sparkfun.com/products/115> (PRT-00115) Break Away Headers - Machine Pin <https://www.sparkfun.com/products/117> (PRT-00117) Break Away Female Headers - Swiss Machine Pin <https://www.sparkfun.com/products/743> (PRT-00743) Stackable Header - 3 Pin (Female, 0.1") <https://www.sparkfun.com/products/13875> (PRT-13875) For SCREWTERMINALS and SPRING TERMINALS visit here: Screw Terimnals on SparkFun.com <https://www.sparkfun.com/search/results?term=Screw+Terminals> (5mm/3.5mm/2.54mm spacing) This device is also useful as a general connection point to wire up your design to another part of your project. Our various solder wires solder well into these plated through hole pads. Hook-Up Wire - Assortment (Stranded, 22 AWG) <https://www.sparkfun.com/products/11375> (PRT-11375) Hook-Up Wire - Assortment (Solid Core, 22 AWG) <https://www.sparkfun.com/products/11367> (PRT-11367) View the entire wire category on our website here <https://www.sparkfun.com/categories/141> Special notes: Molex polarized connector foot print use with SKU : PRT-08232 with associated crimp pins and housings.
S1-S5 = SparkFun:TAC_SWITCH: Momentary Switch Button commonly used for reset or general input. Spark Fun Electronics SKU : COM-00097
S6-S10 S15 = adafruit:EG1218: SLIDING SWITCH 0.1" spacing through hole, vertical SPDT slide switch http://www.ladyada.net/library/pcb/eaglelibrary.html
SG2 = SparkFun:BUZZER: Buzzer 12mm Spark Fun Electronics SKU : Comp-Buzzer
U1 = adafruit:JOYSTICK: Thumb Joystick Joystick commonly found in PS2 controllers. Two pots and a select switch. Adapted from Sparkfun Library (but for more common 6mm switch sticks)
U2 = microbuilder:HT16K33_SOP28
U3 U5 = microbuilder:DAC_MCP4725: MCP4725 - 12-Bit I2C DAC with on-board EEPROM Settling Time: 6 µs 2.7-5.5V Supply 100kHz, 400kHz, 3.4 Mbps I²C EEPROM can be used to store a specific output voltage which will be set coming out of reset I²C Address: 1100 A2 A1 A0 A0 is set via the A0 pin, A2 and A1 are hard-wired on the chip depending on the model chosen: Part Number A2 A1 Code MCP4725A0T-E/CH 0 0 AJNN MCP4725A1T-E/CH 0 1 APNN MCP4725A2T-E/CH 1 0 AQNN MCP4725A3T-E/CH 1 1 ARNN
U$12 U$14 = SparkFun:POT
U$26 = adafruit:XBEE
VR1 = SparkFun-Resistors:POTENTIOMETER: Potentiometer (Pot) Three-terminal potentiometers, with an adjustable wiper and two adjustable resistors. A pot can be used to create a configurable voltage divider, or as a variable resistor. Variants ALPS_POT and ALPS_POT_KIT - PTH, breadboard compatible, 9mm square pots Rotary Potentiometer - Linear (10k ohm) <https://www.sparkfun.com/products/9288> (COM-09288) The KIT variant exposes copper on only one side of the PTH pad, so the part can only be assembled on one side of the PCB. Useful for beginner soldering kits.; PROD_ID: RES-09177; SF_SKU: COM-09288
WIFI = SparkFun-Connectors:CONN_04X2: Multi connection point. Often used as Generic Header-pin footprint for 0.1 inch spaced/style header connections On any of the 0.1 inch spaced packages, you can populate with these: Break Away Headers - Straight <https://www.sparkfun.com/products/116> (PRT-00116) Break Away Male Headers - Right Angle <https://www.sparkfun.com/products/553> (PRT-00553) Female Headers <https://www.sparkfun.com/products/115> (PRT-00115) Break Away Headers - Machine Pin <https://www.sparkfun.com/products/117> (PRT-00117) Break Away Female Headers - Swiss Machine Pin <https://www.sparkfun.com/products/743> (PRT-00743)
X1 = adafruit:HD44780LCD: HD44780 LCD Standard character type LCDs, available in sizes from 8x1 to 40x4!

## Net classes
0 default: width 0.406 mm